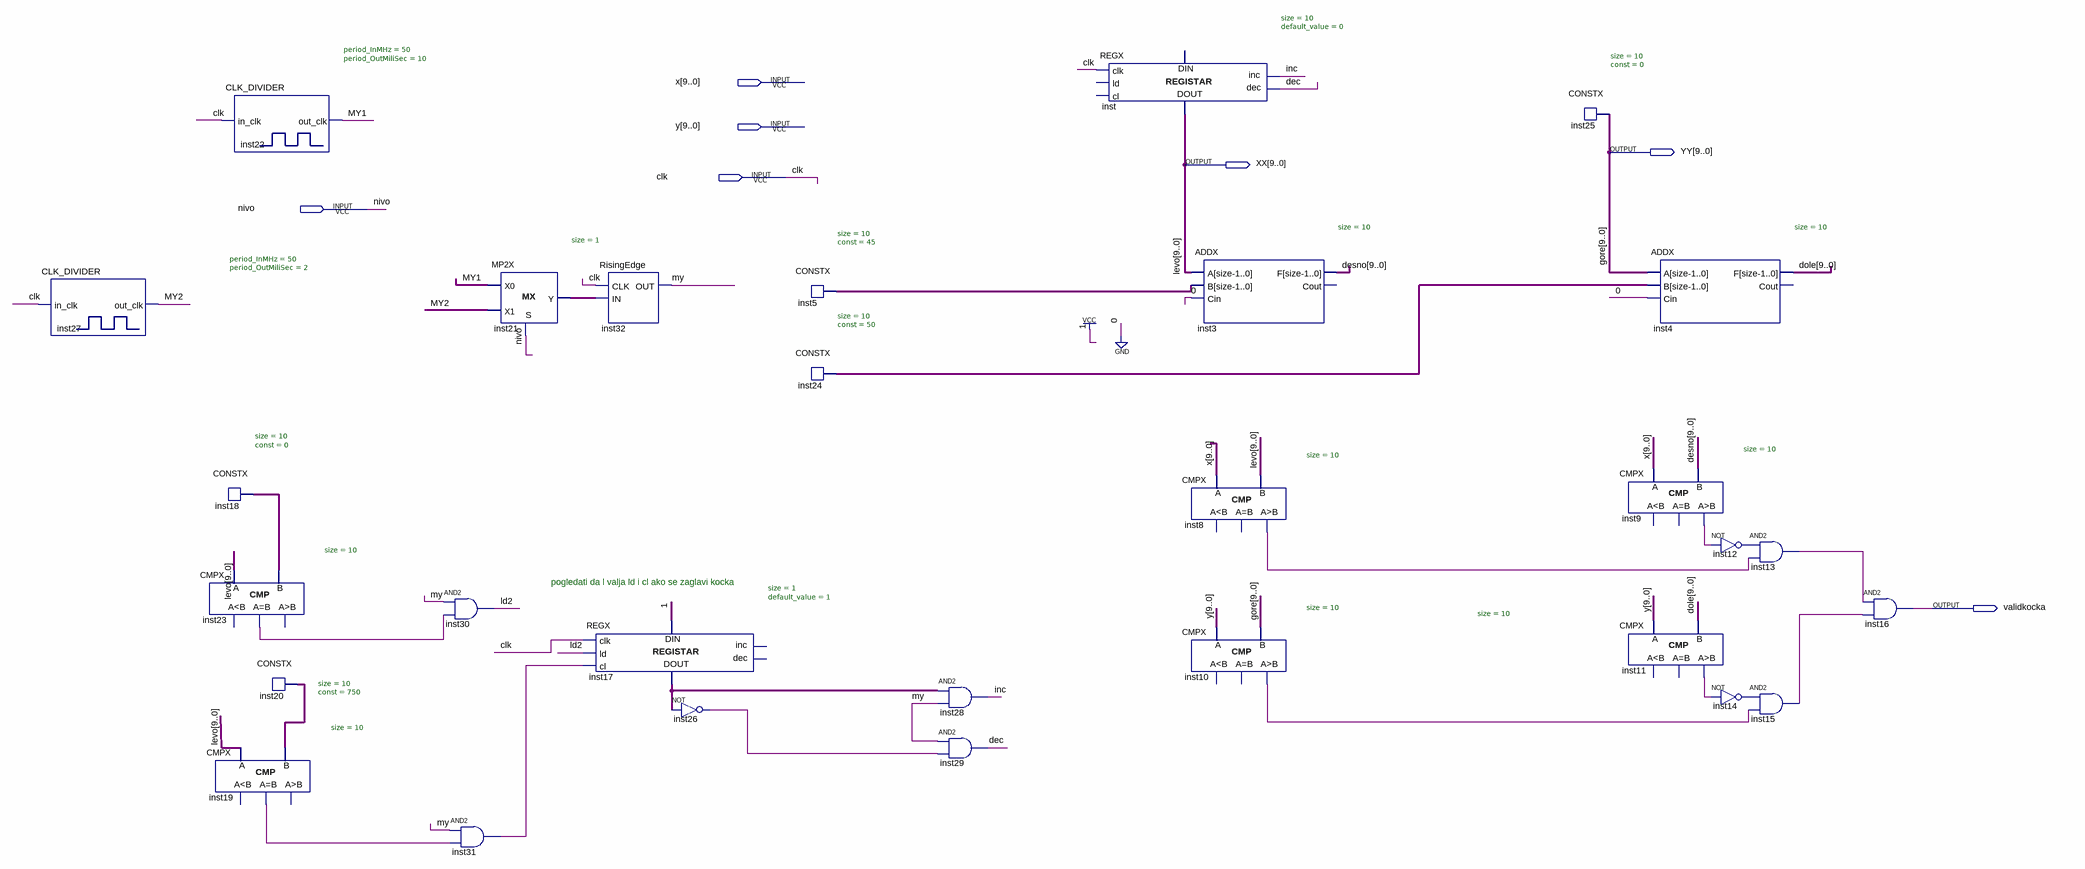
[diagram p0: schematic sheet]
// Quartus schematic kocka3.bdf as structural Verilog: 29 symbols, 7 pins
module kocka3 (
  input  [9:0] x,
  input  [9:0] y,
  input  clk,
  input  nivo,
  output [9:0] YY,
  output [9:0] XX,
  output validkocka
);

  wire dec, inc, inst8_gr, inst9_gr, inst10_gr, inst11_gr, inst12_out, inst13_out, inst14_out, inst15_out,
       inst17_data_out, inst19_eq, inst21_y, inst23_eq, inst26_out, inst31_out, ld2, my, MY1, MY2;
  wire [9:0] desno, dole, inst5_data, inst18_data, inst20_data, inst24_data;

  CLK_DIVIDER #(.period_InMHz(50), .period_OutMiliSec(2)) inst27 (.in_clk(clk), .out_clk(MY2));
  CLK_DIVIDER #(.period_InMHz(50), .period_OutMiliSec(10)) inst22 (.in_clk(clk), .out_clk(MY1));
  CONSTX #(.size(10), .\const (0)) inst18 (.data(inst18_data));
  CMPX #(.size(10)) inst23 (.A(XX), .B(inst18_data), .eq(inst23_eq));  // open: ls, gr
  CMPX #(.size(10)) inst19 (.A(XX), .B(inst20_data), .eq(inst19_eq));  // open: ls, gr
  CONSTX #(.size(10), .\const (750)) inst20 (.data(inst20_data));
  and inst30 (ld2, my, inst23_eq);
  MP2X #(.size(1)) inst21 (.S(nivo), .X0(MY1), .X1(MY2), .Y(inst21_y));
  and inst31 (inst31_out, my, inst19_eq);
  RisingEdge inst32 (.CLK(clk), .IN(inst21_y), .OUT(my));
  REGX #(.size(1), .default_value(1)) inst17 (
    .clk(clk), .ld(ld2), .cl(inst31_out), .data_in(1'b1), .data_out(inst17_data_out));  // open: inc, dec
  not inst26 (inst26_out, inst17_data_out);
  CONSTX #(.size(10), .\const (45)) inst5 (.data(inst5_data));
  CONSTX #(.size(10), .\const (50)) inst24 (.data(inst24_data));
  and inst28 (inc, inst17_data_out, my);
  and inst29 (dec, my, inst26_out);
  REGX #(.size(10), .default_value(0)) inst (.clk(clk), .inc(inc), .dec(dec), .data_out(XX));  // open: ld, cl, data_in
  ADDX #(.size(10)) inst3 (.A(XX), .B(inst5_data), .Cin(1'b0), .F(desno));  // open: Cout
  CMPX #(.size(10)) inst8 (.A(x), .B(XX), .gr(inst8_gr));  // open: ls, eq
  CMPX #(.size(10)) inst10 (.A(y), .B(YY), .gr(inst10_gr));  // open: ls, eq
  CONSTX #(.size(10), .\const (0)) inst25 (.data(YY));
  ADDX #(.size(10)) inst4 (.A(YY), .B(inst24_data), .Cin(1'b0), .F(dole));  // open: Cout
  CMPX #(.size(10)) inst9 (.A(x), .B(desno), .gr(inst9_gr));  // open: ls, eq
  CMPX #(.size(10)) inst11 (.A(y), .B(dole), .gr(inst11_gr));  // open: ls, eq
  not inst12 (inst12_out, inst9_gr);
  not inst14 (inst14_out, inst11_gr);
  and inst13 (inst13_out, inst12_out, inst8_gr);
  and inst15 (inst15_out, inst14_out, inst10_gr);
  and inst16 (validkocka, inst13_out, inst15_out);

  // Other names for the same wires on the sheet: levo[9:0] = XX; gore[9:0] = YY

  // Notes on the sheet:
  //   pogledati da l valja ld i cl ako se zaglavi kocka
endmodule
